# Altium schematic sheet ATRACK_Dongle_V1.SchDoc
size A4
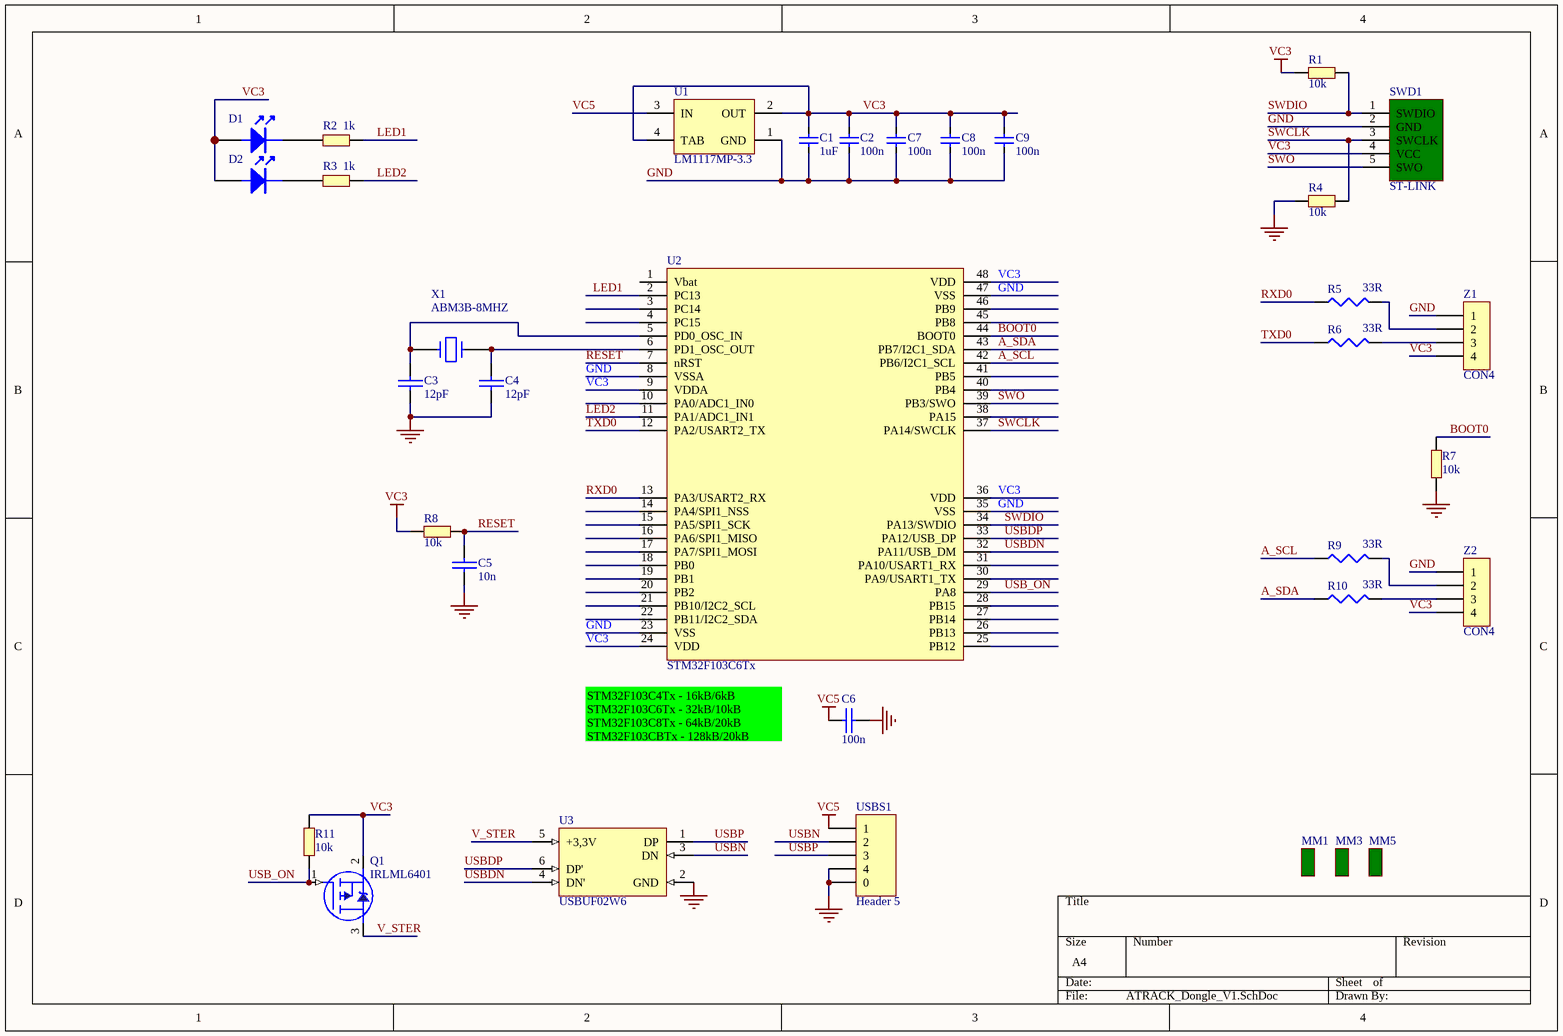
[diagram p0: ATRACK_Dongle_V1.SchDoc]

## Parts
C1  1uF  [0603C]
C2  100n  [0603C]
C3  12pF  [0603C]
C4  12pF  [0603C]
C5  10n  [0603C]
C6  100n  [0603C]
C7  100n  [0603C]
C8  100n  [0603C]
C9  100n  [0603C]
D1  (no value)  [0603LG]
D2  (no value)  [0603LR]
MM1  (no value)  [REF_CIR]
MM3  (no value)  [REF_SQR]
MM5  (no value)  [PB_FREE_GRAF]
Q1  IRLML6401  [SOT23]
R1  10k  [0603R]
R2  1k  [0603R]
R3  1k  [0603R]
R4  10k  [0603R]
R5  33R  [0603R]
R6  33R  [0603R]
R7  10k  [0603R]
R8  10k  [0603R]
R9  33R  [0603R]
R10  33R  [0603R]
R11  10k  [0603R]
SWD1  ST-LINK  [PIN5_SWD]
U1  LM1117MP-3.3  [MP04A_N1]
U2  STM32F103C6Tx  [LQFP48]
U3  USBUF02W6  [SOT323-6L]
USBS1  Header 5  [USB_KR]
X1  ABM3B-8MHZ  [XTAL3]
Z1  CON4  [PIN4]
Z2  CON4  [PIN4]

## Nets
GND: C1.2 C2.2 C3.2 C4.2 C5.2 C6.2 C7.2 C8.2 C9.2 R4.1 R7.2 SWD1.2(GND) U1.1(GND) U2.8(VSSA) U2.23(VSS) U2.35(VSS) U2.47(VSS) U3.2(GND) USBS1.0 USBS1.4 Z1.1 Z2.1
VC3: C1.1 C2.1 C7.1 C8.1 C9.1 D1.A D2.A Q1.2(SOURCE) R1.1 R8.1 R11.2 SWD1.4(VCC) U1.2(OUT) U1.4(TAB) U2.9(VDDA) U2.24(VDD) U2.36(VDD) U2.48(VDD) Z1.4 Z2.4
VC5: C6.1 U1.3(IN) USBS1.1
A_SCL: R9.2 U2.42(PB6/I2C1_SCL)
A_SDA: R10.2 U2.43(PB7/I2C1_SDA)
BOOT0: R7.1 U2.44(BOOT0)
LED1: R2.2 U2.2(PC13)
LED2: R3.2 U2.11(PA1/ADC1_IN1)
RESET: C5.1 R8.2 U2.7(nRST)
RXD0: R5.2 U2.13(PA3/USART2_RX)
SWCLK: R4.2 SWD1.3(SWCLK) U2.37(PA14/SWCLK)
SWDIO: R1.2 SWD1.1(SWDIO) U2.34(PA13/SWDIO)
SWO: SWD1.5(SWO) U2.39(PB3/SWO)
TXD0: R6.2 U2.12(PA2/USART2_TX)
USB_ON: Q1.1(GATE) R11.1 U2.29(PA8)
USBDN: U2.32(PA11/USB_DM) U3.4(DN')
USBDP: U2.33(PA12/USB_DP) U3.6(DP')
USBN: U3.3(DN) USBS1.2
USBP: U3.1(DP) USBS1.3
V_STER: Q1.3(DRAIN) U3.5(+3,3V)
NetC3_1: C3.1 U2.5(PD0_OSC_IN) X1.1
NetC4_1: C4.1 U2.6(PD1_OSC_OUT) X1.3
NetD1_K: D1.K R2.1
NetD2_K: D2.K R3.1
NetR5_1: R5.1 Z1.2
NetR6_1: R6.1 Z1.3
NetR9_1: R9.1 Z2.2
NetR10_1: R10.1 Z2.3

Not connected (* = marked no-connect by the designer): U2 1(Vbat) 3(PC14) 4(PC15) 10(PA0/ADC1_IN0) 14(PA4/SPI1_NSS) 15(PA5/SPI1_SCK) 16(PA6/SPI1_MISO) 17(PA7/SPI1_MOSI) 18(PB0) 19(PB1) 20(PB2) 21(PB10/I2C2_SCL) 22(PB11/I2C2_SDA) 25(PB12) 26(PB13) 27(PB14) 28(PB15) 30(PA9/USART1_TX) 31(PA10/USART1_RX) 38(PA15) 40(PB4) 41(PB5) 45(PB8) 46(PB9)

## Notes on the sheet
- STM32F103C4Tx - 16kB/6kB
  STM32F103C6Tx - 32kB/10kB
  STM32F103C8Tx - 64kB/20kB
  STM32F103CBTx - 128kB/20kB

## Library data of the parts
C1 C2 C7-C9 = CAP
C3-C6 = CAP: Capacitor
D1 D2 = LED
MM1 MM3 MM5 = MECH
Q1 = IRLML9303: Low Charge N-Channel MOSFET
R1-R4 R7 R8 R11 = RES3
R5 R6 R9 R10 = RES1
SWD1 = SW5_CON: Header, 4-Pin; LatestRevisionDate: 17-Jul-2002; LatestRevisionNote: Re-released for DXP Platform.; Publisher: Altium Limited
U1 = LM1117MP-3.3: 800mA Low-Dropout Linear Regulator; Manufacturer: National Semiconductor; CompType: LDO IC; PackageTopMarking: XYTT*N05A; PowerWise: N; Published: 4-Dec-2008; DatasheetVersion: Apr-2006; PackageVersion: revB, Apr-2003; PackageReference: MP04A; Publisher: Altium Limited; PackageDescription: Molded SOT-223, 6.50 x 3.56 x 1.6mm Body, 4 Lead, 2.3mm Pitch; PartNumber: LM1117MP-3.3; RoHS: O; PinCount: 4; DigiKeyPartNumber: LM1117MP-3.3CT-ND; Code_JEDEC: TO-261-AA; Code_IPC: SOT223-4; ComponentLink1Description: LM1117 Datasheet; ComponentLink1URL: http://www.national.com/ds/LM/LM1117.pdf; ComponentLink2Description: LM1117 Web Page; ComponentLink2URL: http://www.national.com/pf/LM/LM1117.html; ComponentLink3Description: MP04A Package Page; ComponentLink3URL: http://www.national.com/packaging/folders/mp04a.html
U2 = STM32F103_LQFP48: STM32F103CxTx
U3 = USBUF01W6
USBS1 = Header 5: Header, 5-Pin; LatestRevisionDate: 17-Jul-2002; LatestRevisionNote: Re-released for DXP Platform.; Publisher: Altium Limited
X1 = CRYSTAL
Z1 Z2 = CON4: Connector